# EAGLE schematic plant long life v1.20 (EAGLE 7.6.0)
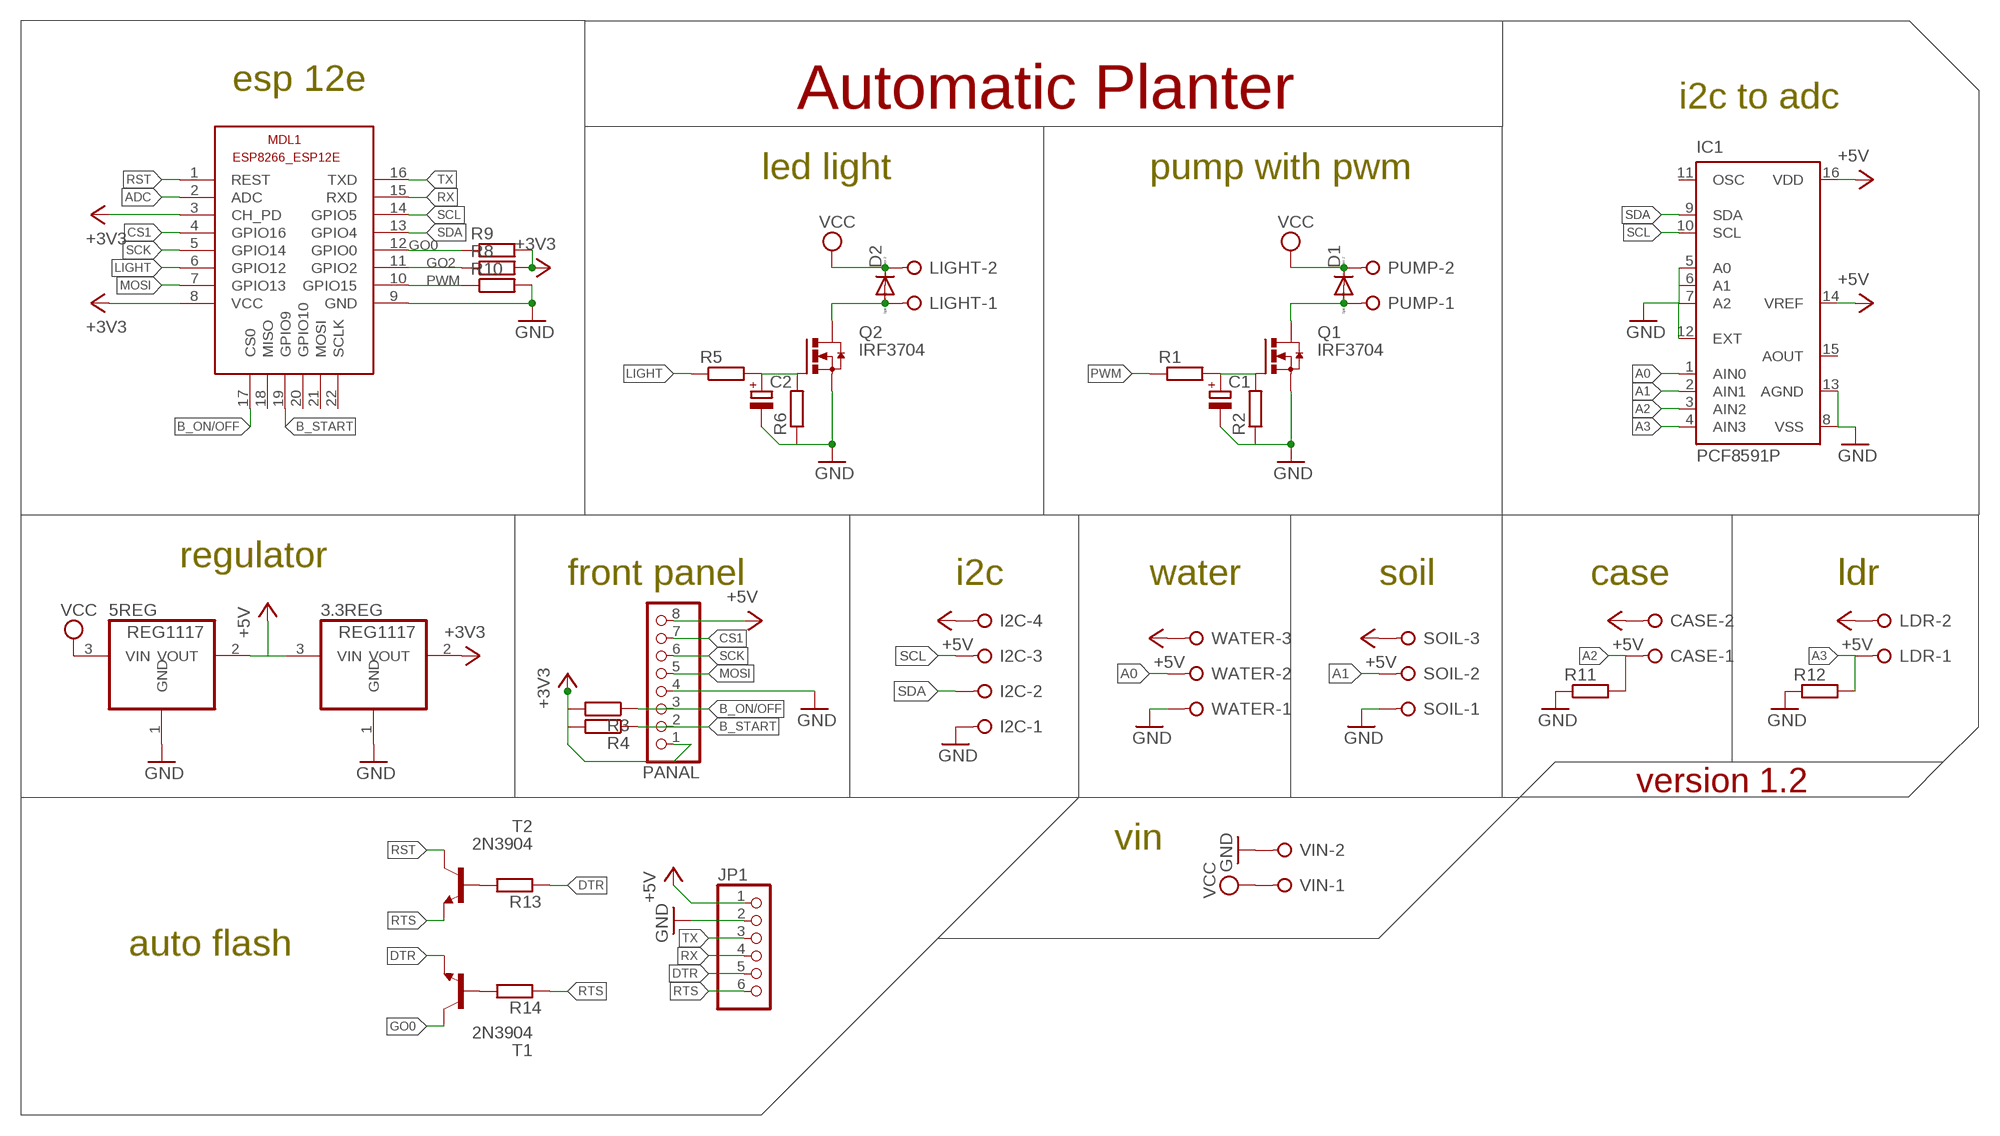
[diagram p0: schematic, sheet 1]

## Parts
3.3REG  REG1117  [SOT223]
5REG  REG1117  [SOT223]
C1  CPOL-EUSMCA  [SMC_A]
C2  CPOL-EUSMCA  [SMC_A]
CASE  W237-02P  [W237-132]
D1  DIODE-DO214AA  [DO214AA]
D2  DIODE-DO214AA  [DO214AA]
I2C  W237-04P  [W237-4P]
IC1  PCF8591P  [DIL16]
JP1  PINHD-1X6  [1X06]
LDR  W237-02P  [W237-132]
LIGHT  W237-02P  [W237-132]
MDL1  ESP8266-12EESP8266-ESP12E  [ESP8266-ESP12E]
PANAL  PINHD-1X8  [1X08]
PUMP  W237-02P  [W237-132]
Q1  IRF3704  [TO220AH]
Q2  IRF3704  [TO220AH]
R1  R-EU_R0805  [R0805]
R2  R-EU_R0805  [R0805]
R3  R-EU_R0805  [R0805]
R4  R-EU_R0805  [R0805]
R5  R-EU_R0805  [R0805]
R6  R-EU_R0805  [R0805]
R8  R-EU_R0603  [R0603]
R9  R-EU_R0603  [R0603]
R10  R-EU_R0603  [R0603]
R11  R-EU_R0805  [R0805]
R12  R-EU_R0805  [R0805]
R13  R-EU_0204/7  [0204/7]
R14  R-EU_0204/7  [0204/7]
SOIL  W237-3E  [W237-3E]
T1  2N3904  [TO92]
T2  2N3904  [TO92]
VIN  W237-02P  [W237-132]
WATER  W237-3E  [W237-3E]

## Nets
+3V3: 3.3REG.2(VOUT) MDL1.3(CH_PD) MDL1.8(VCC) PANAL.1 R3.2 R4.2 R8.2 R9.2
+5V: 3.3REG.3(VIN) 5REG.2(VOUT) CASE.2 I2C.4 IC1.14(VREF) IC1.16(VDD) JP1.1 LDR.2 PANAL.8 SOIL.3 WATER.3
A0: IC1.1(AIN0) WATER.2
A1: IC1.2(AIN1) SOIL.2
A2: CASE.1 IC1.3(AIN2) R11.2
A3: IC1.4(AIN3) LDR.1 R12.2
ADC: MDL1.2(ADC)
B_ON/OFF: MDL1.17(CS0) PANAL.3 R3.1
B_START: MDL1.19(GPIO9) PANAL.2 R4.1
CS1: MDL1.4(GPIO16) PANAL.7
DTR: JP1.5 R13.1 T1.3(E)
GND: 3.3REG.1(GND) 5REG.1(GND) C1.- C2.- I2C.1 IC1.5(A0) IC1.6(A1) IC1.7(A2) IC1.8(VSS) IC1.12(EXT) IC1.13(AGND) JP1.2 MDL1.9(GND) PANAL.4 Q1.E(S) Q2.E(S) R2.1 R6.1 R10.2 R11.1 R12.1 SOIL.1 VIN.2 WATER.1
GO0: MDL1.12(GPIO0) R9.1 T1.1(C)
GO2: MDL1.11(GPIO2) R8.1
LIGHT: MDL1.6(GPIO12) R5.1
MOSI: MDL1.7(GPIO13) PANAL.5
N$1: D1.A PUMP.1 Q1.C(D)
N$2: C1.+ Q1.B(G) R1.2 R2.2
N$3: D2.A LIGHT.1 Q2.C(D)
N$4: R13.2 T2.2(B)
N$5: R14.2 T1.2(B)
N$6: C2.+ Q2.B(G) R5.2 R6.2
PWM: MDL1.10(GPIO15) R1.1 R10.1
RST: MDL1.1(REST) T2.1(C)
RTS: JP1.6 R14.1 T2.3(E)
RX: JP1.4 MDL1.15(RXD)
SCK: MDL1.5(GPIO14) PANAL.6
SCL: I2C.3 IC1.10(SCL) MDL1.14(GPIO5)
SDA: I2C.2 IC1.9(SDA) MDL1.13(GPIO4)
TX: JP1.3 MDL1.16(TXD)
VCC: 5REG.3(VIN) D1.C D2.C LIGHT.2 PUMP.2 VIN.1
Unconnected: IC1.11(OSC) IC1.15(AOUT) MDL1.18(MISO) MDL1.20(GPIO10) MDL1.21(MOSI) MDL1.22(SCLK)

## Notes on the sheet
- esp 12e
- Automatic Planter | i2c to adc
- led light | pump with pwm
- regulator
- front panel | i2c | water | soil | case | ldr
- version 1.2
- vin
- auto flash

## Library data of the parts
3.3REG 5REG = burr-brown:REG1117: 800mA and 1A Low Dropout (LDO) Positive Regulator 1.8V, 2.5V, 2.85V, 3.3V, 5V, and Adj; MPN: REG1117; OC_FARNELL: 1097566; OC_NEWARK: 14P6981
C1 C2 = resistor:CPOL-EU: POLARIZED CAPACITOR, European symbol
CASE LDR LIGHT PUMP VIN = con-wago-508:W237-02P: WAGO SREW CLAMP; OC_FARNELL: unknown; OC_NEWARK: unknown
D1 D2 = diode:DIODE-: DIODE
I2C = con-wago-508:W237-04P: WAGO SREW CLAMP; OC_FARNELL: unknown; OC_NEWARK: unknown
IC1 = micro-philips:PCF8591: I2C-Bus D/A CONVERTER; MF: FARNELL; MPN: PCF8591P; OC_FARNELL: 396412; OC_NEWARK: 07WX3385
JP1 = pinhead:PINHD-1X6: PIN HEADER
MDL1 = ESP8266-ESP12E:ESP8266-12E: ESP8266-12E with additional I/O and GPIO04/05 corrected The author cannot warrant that this library is free from error or will meet your specific requirements. Created by PuceBaboon.com. Komagane, Nagano, JAPAN
PANAL = pinhead:PINHD-1X8: PIN HEADER
Q1 Q2 = transistor-power:IRF3704: SMPS MOSFET HEXFET® Power MOSFET Source: http://www.irf.com/product-info/datasheets/data/irf3704.pdf
R1-R6 R8-R14 = rcl:R-EU_: RESISTOR, European symbol
SOIL WATER = con-wago-508:W237-3E: WAGO SREW CLAMP; OC_FARNELL: unknown; OC_NEWARK: unknown
T1 T2 = transistor-neu-to92:2N3904: NPN TRANSISTOR